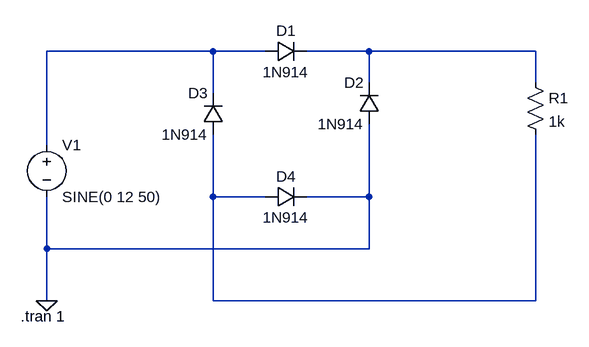
[diagram p0: schematic tam_dalga_transiet_analiz.asc]
tam_dalga_transiet_analiz.asc, the LTspice schematic file:
Version 4
SHEET 1 952 680
WIRE 400 0 144 0
WIRE 480 0 400 0
WIRE 640 0 544 0
WIRE 896 0 640 0
WIRE 640 48 640 0
WIRE 896 48 896 0
WIRE 400 64 400 0
WIRE 144 144 144 0
WIRE 400 224 400 128
WIRE 480 224 400 224
WIRE 640 224 640 112
WIRE 640 224 544 224
WIRE 144 304 144 224
WIRE 640 304 640 224
WIRE 640 304 144 304
WIRE 144 384 144 304
WIRE 400 384 400 224
WIRE 896 384 896 128
WIRE 896 384 400 384
FLAG 144 384 0
SYMBOL voltage 144 128 R0
WINDOW 123 0 0 Left 0
WINDOW 39 0 0 Left 0
SYMATTR InstName V1
SYMATTR Value SINE(0 12 50)
SYMBOL diode 480 16 R270
WINDOW 0 32 32 VTop 2
WINDOW 3 0 32 VBottom 2
SYMATTR InstName D1
SYMATTR Value 1N914
SYMBOL diode 656 112 R180
WINDOW 0 24 64 Left 2
WINDOW 3 24 0 Left 2
SYMATTR InstName D2
SYMATTR Value 1N914
SYMBOL diode 416 128 R180
WINDOW 0 24 64 Left 2
WINDOW 3 24 0 Left 2
SYMATTR InstName D3
SYMATTR Value 1N914
SYMBOL diode 480 240 R270
WINDOW 0 32 32 VTop 2
WINDOW 3 0 32 VBottom 2
SYMATTR InstName D4
SYMATTR Value 1N914
SYMBOL res 880 32 R0
SYMATTR InstName R1
SYMATTR Value 1k
TEXT 104 408 Left 2 !.tran 1

The netlist it stands for:
* tam_dalga_transiet_analiz.asc
V1 N001 0 SINE(0 12 50)
D1 N001 N002 1N914
D2 0 N002 1N914
D3 N003 N001 1N914
D4 N003 0 1N914
R1 N002 N003 1k
.model D D
.lib standard.dio
.tran 1
.backanno
.end